# Altium project TLM_schematic.PrjPcb
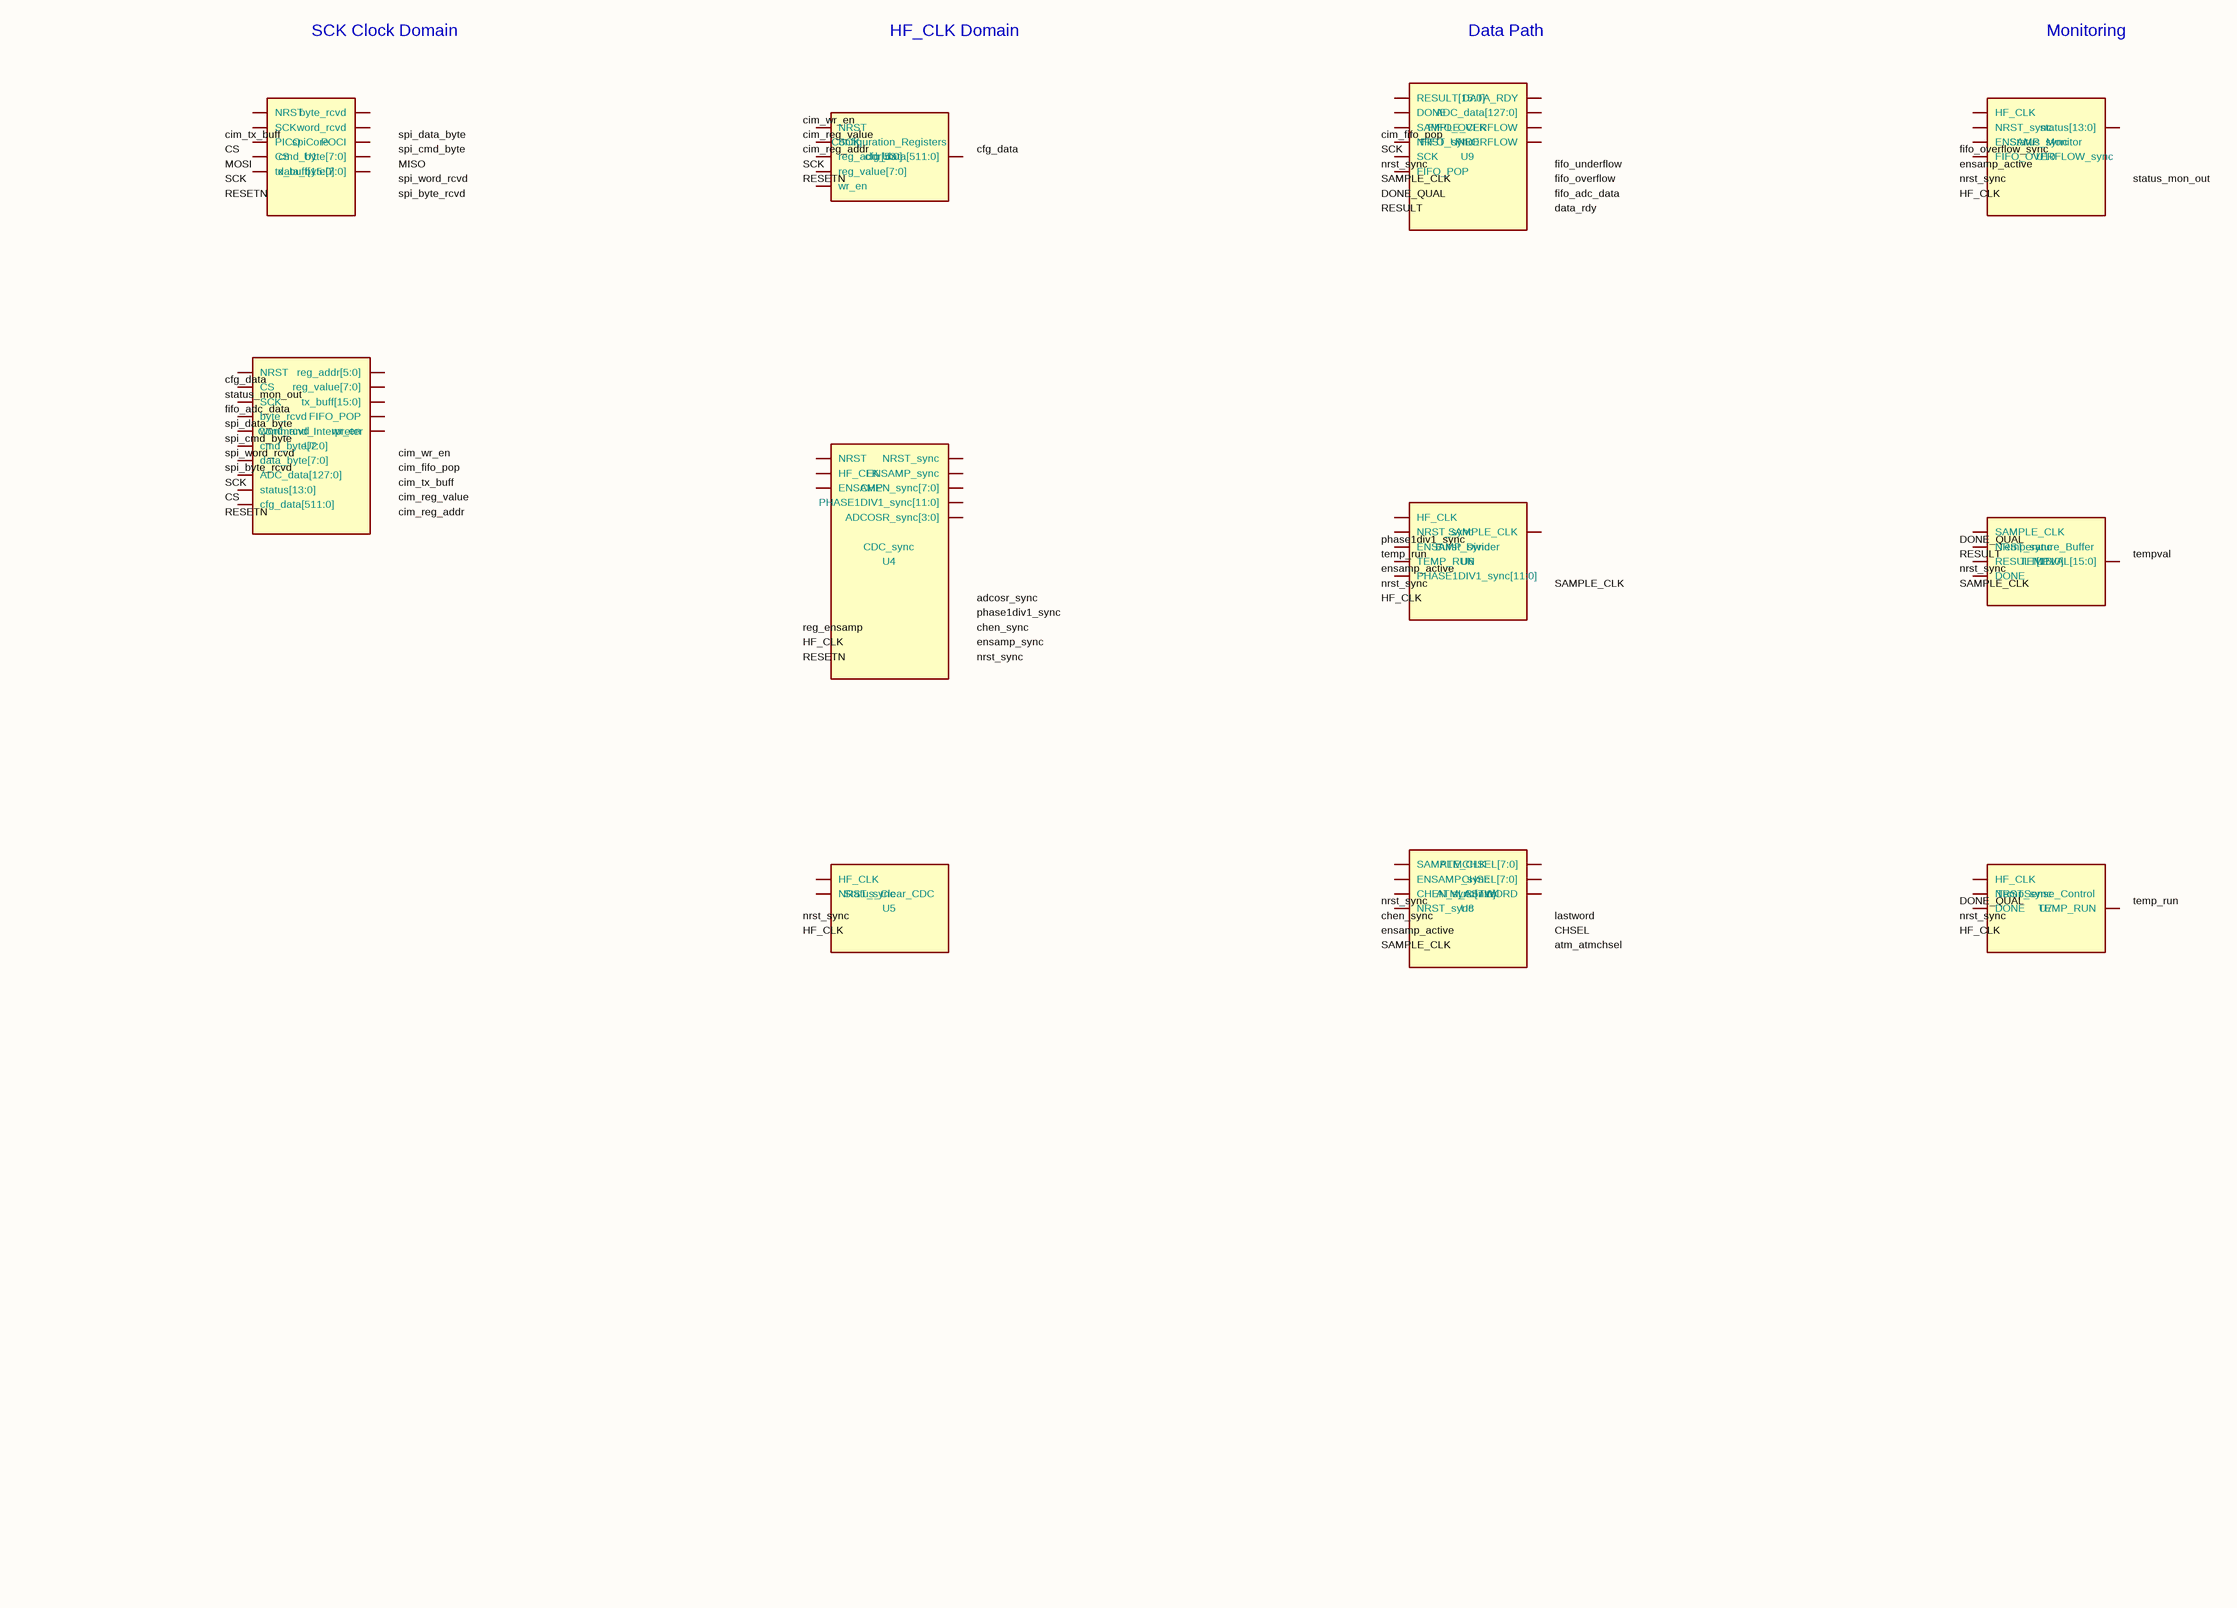
[diagram p0: TLM_schematic.SchDoc]
1 sheet, 11 parts. Net scope: global (net labels, ports and power ports of the same name join across sheets).

## Sheet TLM_schematic.SchDoc
size 420 x 297 mm

### Parts
U1  spiCore
U2  Command_Interpreter
U3  Configuration_Registers
U4  CDC_sync
U5  Status_Clear_CDC
U6  Burst_Divider
U7  TempSense_Control
U8  ATM_Control
U9  FIFO
U10  Status_Monitor
U11  Temperature_Buffer

### Nets

Not connected (* = marked no-connect by the designer): U1 byte_rcvd cmd_byte[7:0] CS data_byte[7:0] NRST PICO POCI SCK tx_buff[15:0] word_rcvd; U2 ADC_data[127:0] byte_rcvd cfg_data[511:0] cmd_byte[7:0] CS data_byte[7:0] FIFO_POP NRST reg_addr[5:0] reg_value[7:0] SCK status[13:0] tx_buff[15:0] word_rcvd wr_en; U3 cfg_data[511:0] NRST reg_addr[5:0] reg_value[7:0] SCK wr_en; U4 ADCOSR_sync[3:0] CHEN_sync[7:0] ENSAMP ENSAMP_sync HF_CLK NRST NRST_sync PHASE1DIV1_sync[11:0]; U5 HF_CLK NRST_sync; U6 ENSAMP_sync HF_CLK NRST_sync PHASE1DIV1_sync[11:0] SAMPLE_CLK TEMP_RUN; U7 DONE HF_CLK NRST_sync TEMP_RUN; U8 ATMCHSEL[7:0] CHEN_sync[7:0] CHSEL[7:0] ENSAMP_sync LASTWORD NRST_sync SAMPLE_CLK; U9 ADC_data[127:0] DATA_RDY DONE FIFO_OVERFLOW FIFO_POP FIFO_UNDERFLOW NRST_sync RESULT[15:0] SAMPLE_CLK SCK; U10 ENSAMP_sync FIFO_OVERFLOW_sync HF_CLK NRST_sync status[13:0]; U11 DONE NRST_sync RESULT[15:0] SAMPLE_CLK TEMPVAL[15:0]

### Notes on the sheet
- SCK Clock Domain
- HF_CLK Domain
- (near U9) Data Path
- Monitoring
- Labels drawn without touching a wire or pin: adcosr_sync, atm_atmchsel, cfg_data, chen_sync, CHSEL, cim_fifo_pop, cim_reg_addr, cim_reg_value, cim_tx_buff, cim_wr_en, CS, data_rdy, DONE_QUAL, ensamp_active, ensamp_sync, fifo_adc_data, fifo_overflow, fifo_overflow_sync, fifo_underflow, HF_CLK, lastword, MISO, MOSI, nrst_sync, phase1div1_sync, reg_ensamp, RESETN, RESULT, SAMPLE_CLK, SCK, spi_byte_rcvd, spi_cmd_byte, spi_data_byte, spi_word_rcvd, status_mon_out, temp_run, tempval
- 1
- 2
- 3
- 4
- 5
- 6
- 7
- 8
- A
- B
- C
- D
- E
- Digital Core Schematic
- 11 Submodules + Clock Domain Crossing
- Title: Pepper T4 - Top Level Module (TLM)
- File: TLM_schematic.kicad_sch
- Sheet: /
- MINT NEURO
- F
- KiCad E.D.A.  kicad (5.1.4)-1
- Size: A3
- Date: 2026-02-12
- Rev: 1.0
- Id: 1/1

### Library data of the parts
U6 = Dual_phase_gated_burst_divider: Value: Burst_Divider
U1 = spiCore: Value: spiCore
U2 = Command_Interpreter: Value: Command_Interpreter
U3 = Configuration_Registers: Value: Configuration_Registers
U4 = CDC_sync: Value: CDC_sync
U5 = Status_Clear_CDC: Value: Status_Clear_CDC
U7 = TempSense_Control: Value: TempSense_Control
U8 = ATM_Control: Value: ATM_Control
U9 = FIFO: Value: FIFO
U10 = Status_Monitor: Value: Status_Monitor
U11 = Temperature_Buffer: Value: Temperature_Buffer